# Altium schematic sheet VISHIPEL_ver1.2.SchDoc: mach_mau
size 594 x 420 mm; Author: thaipham; SheetNumber: 1; SheetTotal: 1
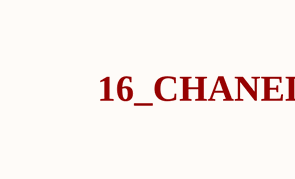
[diagram p0: VISHIPEL_ver1.2.SchDoc, top left]
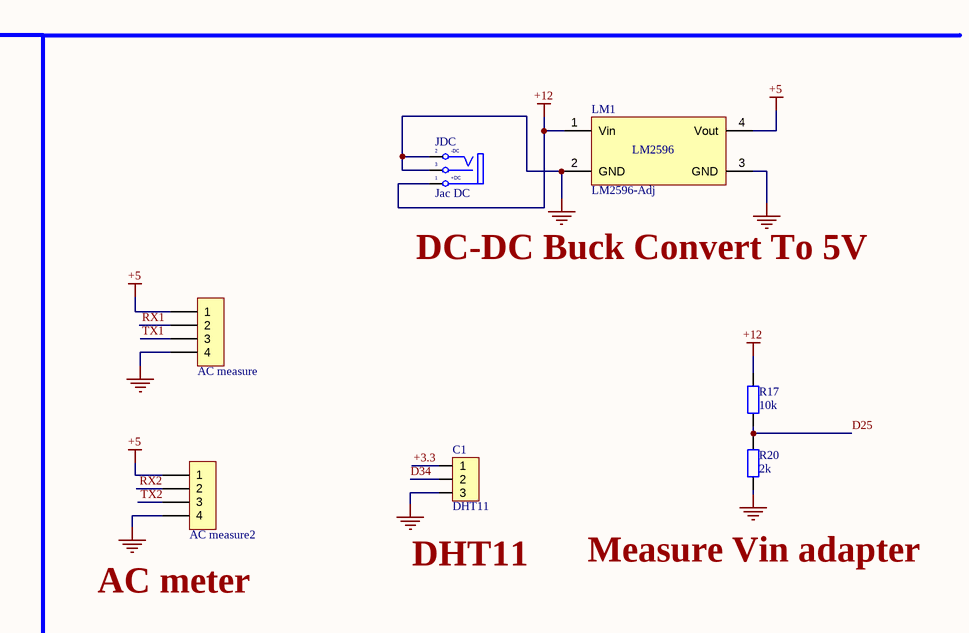
[diagram p1: VISHIPEL_ver1.2.SchDoc, top right]
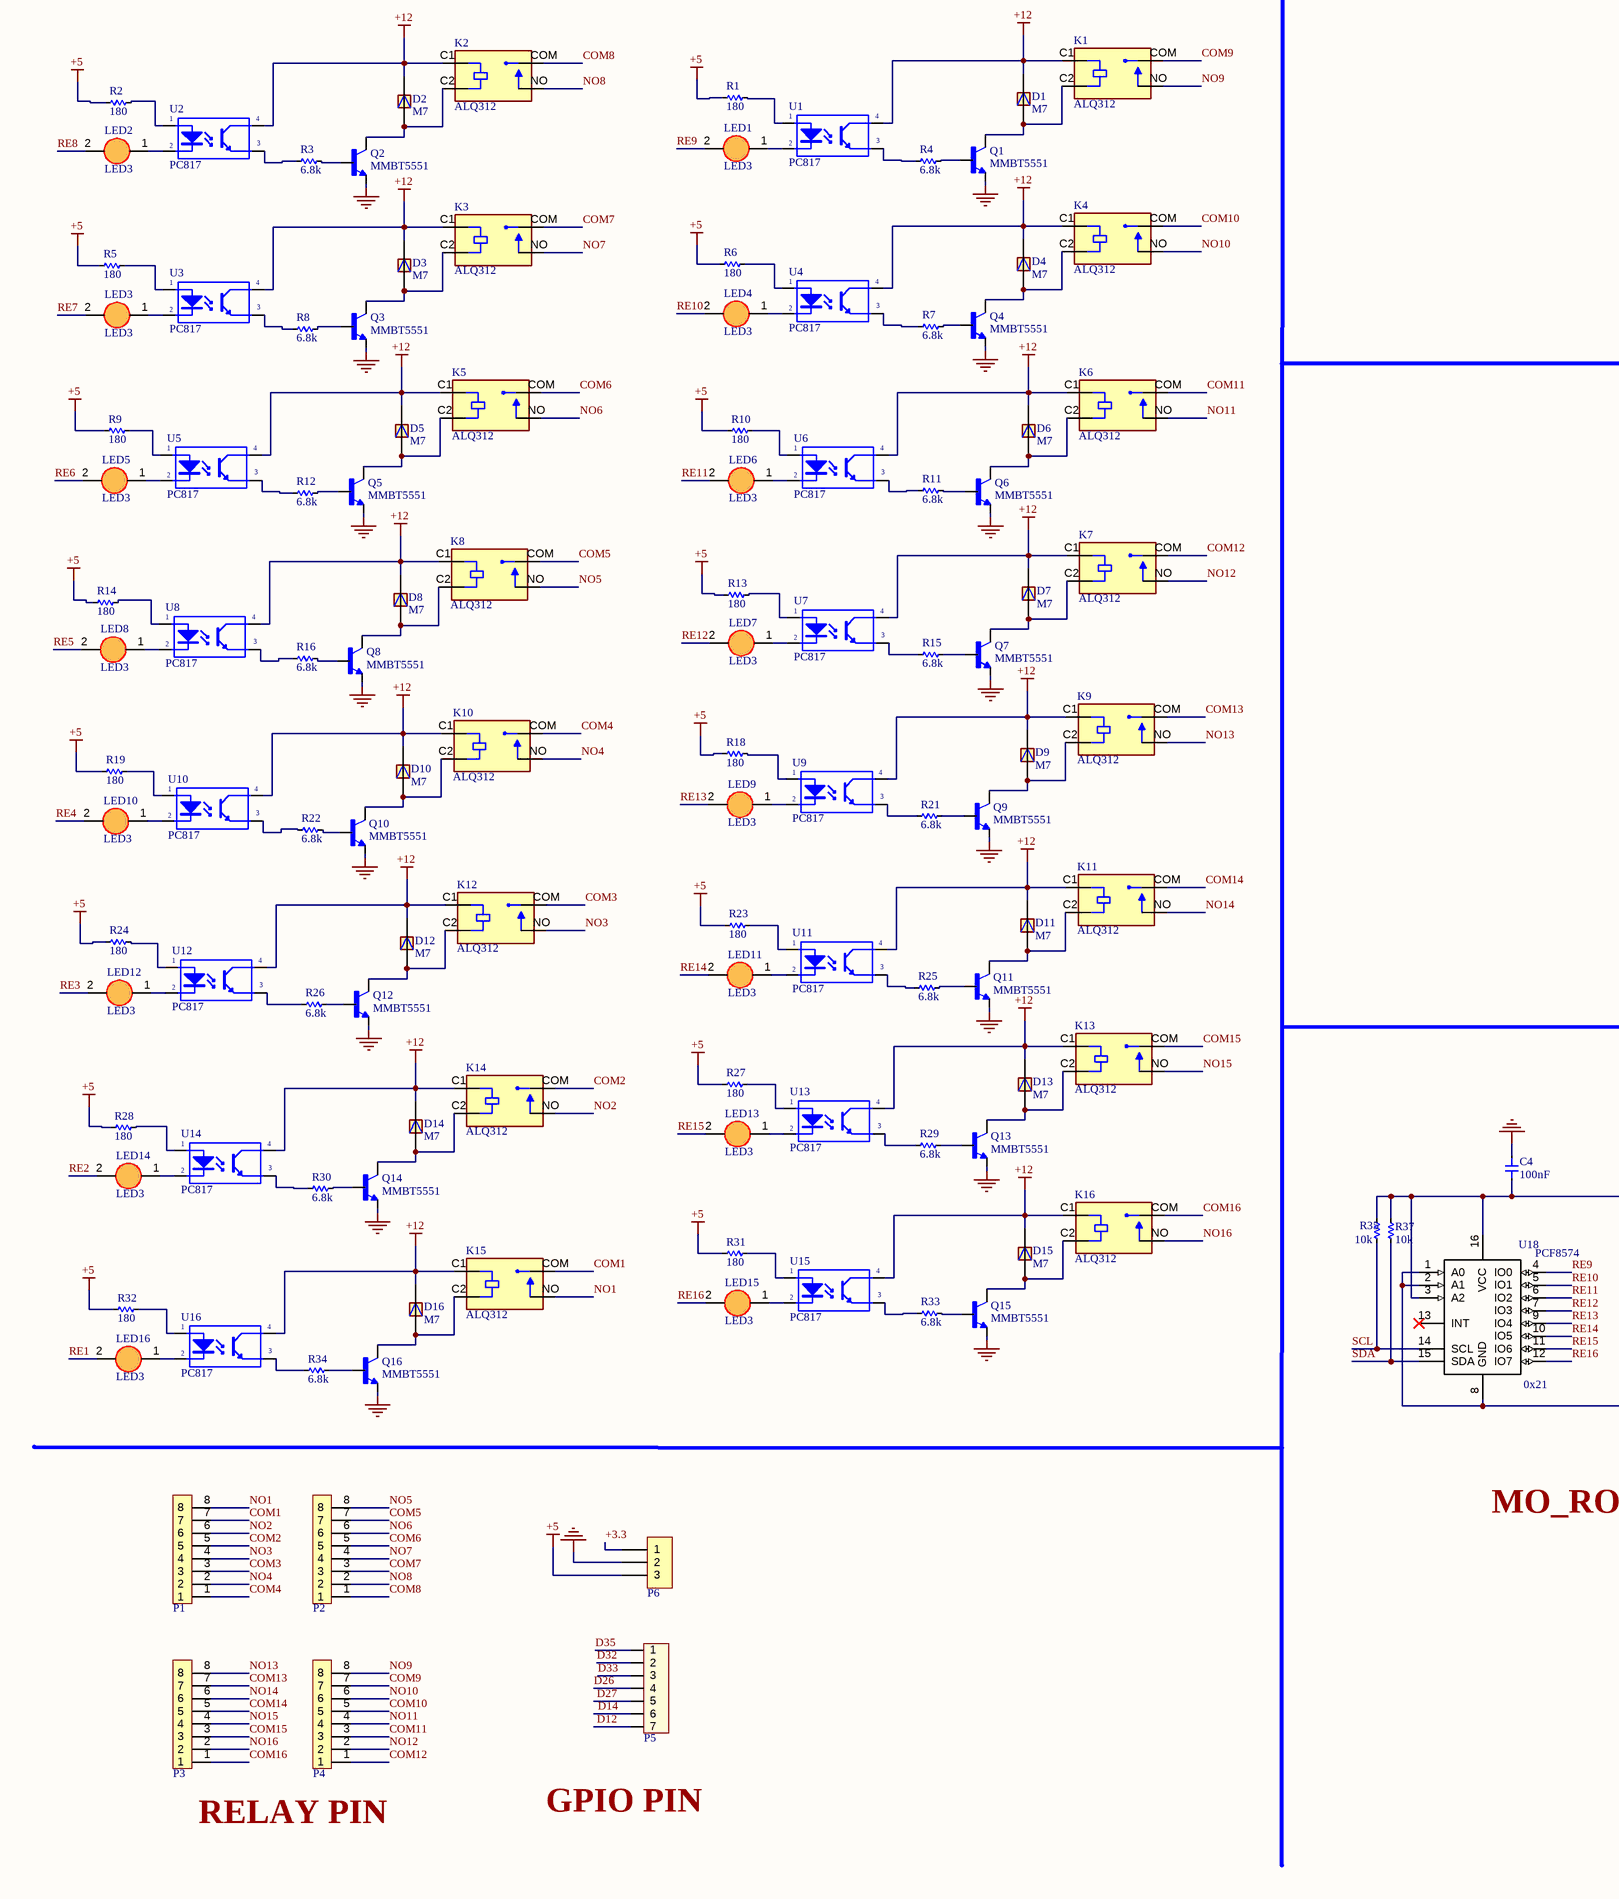
[diagram p2: VISHIPEL_ver1.2.SchDoc, bottom left]
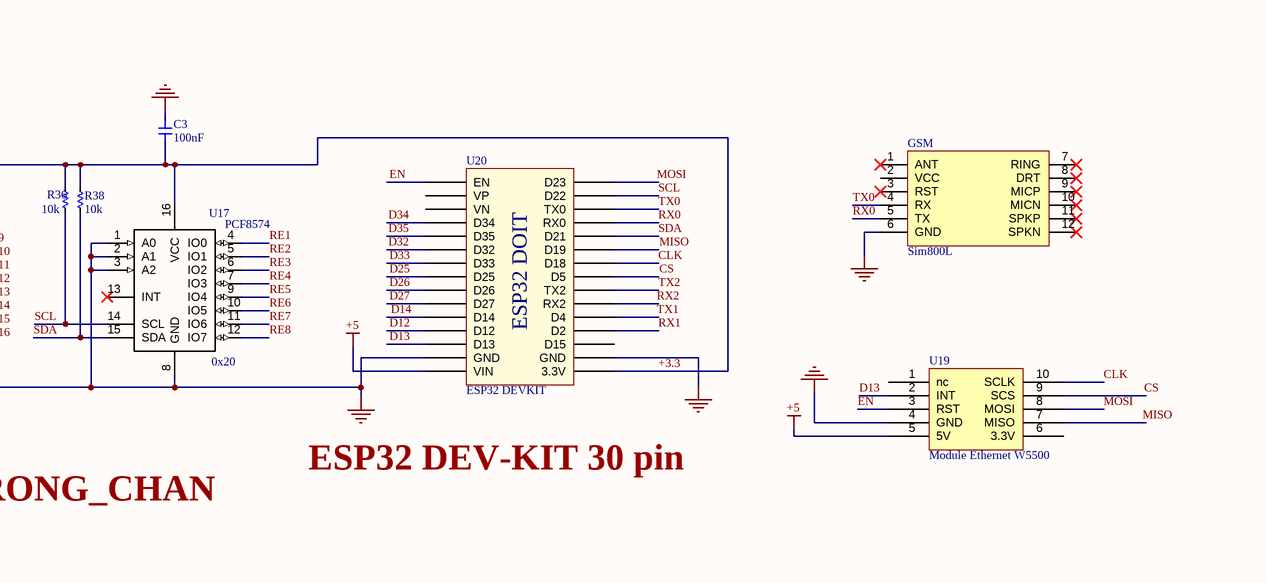
[diagram p3: VISHIPEL_ver1.2.SchDoc, bottom right]

## Parts
C1  DHT11  [Header3]
C3  100nF  [Cap 0805]
C4  100nF  [Cap 0805]
D1  M7  [DIOM505270X240]
D2  M7  [DIOM505270X240]
D3  M7  [DIOM505270X240]
D4  M7  [DIOM505270X240]
D5  M7  [DIOM505270X240]
D6  M7  [DIOM505270X240]
D7  M7  [DIOM505270X240]
D8  M7  [DIOM505270X240]
D9  M7  [DIOM505270X240]
D10  M7  [DIOM505270X240]
D11  M7  [DIOM505270X240]
D12  M7  [DIOM505270X240]
D13  M7  [DIOM505270X240]
D14  M7  [DIOM505270X240]
D15  M7  [DIOM505270X240]
D16  M7  [DIOM505270X240]
GSM  Sim800L  [Sim800L]
H1  AC measure  [XH2.54M-4]
H2  AC measure2  [XH2.54M-4]
H3  P6  [VH3.96M-3]
H4  P5  [VH3.96M-7]
JDC  Jac DC  [DC-IN]
K1  ALQ312  [RELAY_ALQ312]
K2  ALQ312  [RELAY_ALQ312]
K3  ALQ312  [RELAY_ALQ312]
K4  ALQ312  [RELAY_ALQ312]
K5  ALQ312  [RELAY_ALQ312]
K6  ALQ312  [RELAY_ALQ312]
K7  ALQ312  [RELAY_ALQ312]
K8  ALQ312  [RELAY_ALQ312]
K9  ALQ312  [RELAY_ALQ312]
K10  ALQ312  [RELAY_ALQ312]
K11  ALQ312  [RELAY_ALQ312]
K12  ALQ312  [RELAY_ALQ312]
K13  ALQ312  [RELAY_ALQ312]
K14  ALQ312  [RELAY_ALQ312]
K15  ALQ312  [RELAY_ALQ312]
K16  ALQ312  [RELAY_ALQ312]
LED1  LED3  [LED3mm]
LED2  LED3  [LED3mm]
LED3  LED3  [LED3mm]
LED4  LED3  [LED3mm]
LED5  LED3  [LED3mm]
LED6  LED3  [LED3mm]
LED7  LED3  [LED3mm]
LED8  LED3  [LED3mm]
LED9  LED3  [LED3mm]
LED10  LED3  [LED3mm]
LED11  LED3  [LED3mm]
LED12  LED3  [LED3mm]
LED13  LED3  [LED3mm]
LED14  LED3  [LED3mm]
LED15  LED3  [LED3mm]
LED16  LED3  [LED3mm]
LM1  LM2596-Adj  [lm2596]
P1  BIG Heager 8  [BIG_Header 8]  (value not drawn)
P2  BIG Heager 8  [BIG_Header 8]  (value not drawn)
P3  BIG Heager 8  [BIG_Header 8]  (value not drawn)
P4  BIG Heager 8  [BIG_Header 8]  (value not drawn)
Q1  MMBT5551  [SOT23-3]
Q2  MMBT5551  [SOT23-3]
Q3  MMBT5551  [SOT23-3]
Q4  MMBT5551  [SOT23-3]
Q5  MMBT5551  [SOT23-3]
Q6  MMBT5551  [SOT23-3]
Q7  MMBT5551  [SOT23-3]
Q8  MMBT5551  [SOT23-3]
Q9  MMBT5551  [SOT23-3]
Q10  MMBT5551  [SOT23-3]
Q11  MMBT5551  [SOT23-3]
Q12  MMBT5551  [SOT23-3]
Q13  MMBT5551  [SOT23-3]
Q14  MMBT5551  [SOT23-3]
Q15  MMBT5551  [SOT23-3]
Q16  MMBT5551  [SOT23-3]
R1  180  [RES-SMD-0101]
R2  180  [RES-SMD-0101]
R3  6.8k  [RES-SMD-0101]
R4  6.8k  [RES-SMD-0101]
R5  180  [RES-SMD-0101]
R6  180  [RES-SMD-0101]
R7  6.8k  [RES-SMD-0101]
R8  6.8k  [RES-SMD-0101]
R9  180  [RES-SMD-0101]
R10  180  [RES-SMD-0101]
R11  6.8k  [RES-SMD-0101]
R12  6.8k  [RES-SMD-0101]
R13  180  [RES-SMD-0101]
R14  180  [RES-SMD-0101]
R15  6.8k  [RES-SMD-0101]
R16  6.8k  [RES-SMD-0101]
R17  value 10k  [DIEN TRO 1/4 W]  (hidden comment: R0.4W)
R18  180  [RES-SMD-0101]
R19  180  [RES-SMD-0101]
R20  value 2k  [DIEN TRO 1/4 W]  (hidden comment: R0.4W)
R21  6.8k  [RES-SMD-0101]
R22  6.8k  [RES-SMD-0101]
R23  180  [RES-SMD-0101]
R24  180  [RES-SMD-0101]
R25  6.8k  [RES-SMD-0101]
R26  6.8k  [RES-SMD-0101]
R27  180  [RES-SMD-0101]
R28  180  [RES-SMD-0101]
R29  6.8k  [RES-SMD-0101]
R30  6.8k  [RES-SMD-0101]
R31  180  [RES-SMD-0101]
R32  180  [RES-SMD-0101]
R33  6.8k  [RES-SMD-0101]
R34  6.8k  [RES-SMD-0101]
R35  10k  [RES-SMD-0101]
R36  10k  [RES-SMD-0101]
R37  10k  [RES-SMD-0101]
R38  10k  [RES-SMD-0101]
U1  PC817  [DIP4/W0.3]
U2  PC817  [DIP4/W0.3]
U3  PC817  [DIP4/W0.3]
U4  PC817  [DIP4/W0.3]
U5  PC817  [DIP4/W0.3]
U6  PC817  [DIP4/W0.3]
U7  PC817  [DIP4/W0.3]
U8  PC817  [DIP4/W0.3]
U9  PC817  [DIP4/W0.3]
U10  PC817  [DIP4/W0.3]
U11  PC817  [DIP4/W0.3]
U12  PC817  [DIP4/W0.3]
U13  PC817  [DIP4/W0.3]
U14  PC817  [DIP4/W0.3]
U15  PC817  [DIP4/W0.3]
U16  PC817  [DIP4/W0.3]
U17  PCF8574  [DIP16]
U18  PCF8574  [DIP16]
U19  Module Ethernet W5500  [Module Ethernet W5500]
U20  ESP32 DEVKIT  [ESP32 WROOM 32 KIT]

## Nets
+5: H1.1 H2.1 H3.3 LM1.4(Vout) R1.1 R2.1 R5.1 R6.1 R9.1 R10.1 R13.1 R14.1 R18.1 R19.1 R23.1 R24.1 R27.1 R28.1 R31.1 R32.1 U19.5(5V) U20.15(VIN)
+12: D1.C D2.C D3.C D4.C D5.C D6.C D7.C D8.C D9.C D10.C D11.C D12.C D13.C D14.C D15.C D16.C JDC.1(T) K1.C1(COIL1) K2.C1(COIL1) K3.C1(COIL1) K4.C1(COIL1) K5.C1(COIL1) K6.C1(COIL1) K7.C1(COIL1) K8.C1(COIL1) K9.C1(COIL1) K10.C1(COIL1) K11.C1(COIL1) K12.C1(COIL1) K13.C1(COIL1) K14.C1(COIL1) K15.C1(COIL1) K16.C1(COIL1) LM1.1(Vin) R17.2 U1.4(C) U2.4(C) U3.4(C) U4.4(C) U5.4(C) U6.4(C) U7.4(C) U8.4(C) U9.4(C) U10.4(C) U11.4(C) U12.4(C) U13.4(C) U14.4(C) U15.4(C) U16.4(C)
GND: C1.3 C3.1 C4.1 GSM.6(GND) H1.4 H2.4 H3.2 JDC.2(TN) JDC.3(S) LM1.2(GND) LM1.3(GND) Q1.2(E) Q2.2(E) Q3.2(E) Q4.2(E) Q5.2(E) Q6.2(E) Q7.2(E) Q8.2(E) Q9.2(E) Q10.2(E) Q11.2(E) Q12.2(E) Q13.2(E) Q14.2(E) Q15.2(E) Q16.2(E) R20.1 U17.1(A0) U17.2(A1) U17.3(A2) U17.8(GND) U18.1(A0) U18.2(A1) U18.8(GND) U19.4(GND) U20.14(GND) U20.17(GND)
+3.3: C1.1 C3.2 C4.2 H3.1 R35.1 R36.1 R37.1 R38.1 U17.16(VCC) U18.3(A2) U18.16(VCC) U20.16(3.3V)
CLK: U19.10(SCLK) U20.24(D18)
COM1: K15.COM P1.7
COM2: K14.COM P1.5
COM3: K12.COM P1.3
COM4: K10.COM P1.1
COM5: K8.COM P2.7
COM6: K5.COM P2.5
COM7: K3.COM P2.3
COM8: K2.COM P2.1
COM9: K1.COM P4.7
COM10: K4.COM P4.5
COM11: K6.COM P4.3
COM12: K7.COM P4.1
COM13: K9.COM P3.7
COM14: K11.COM P3.5
COM15: K13.COM P3.3
COM16: K16.COM P3.1
CS: U19.9(SCS) U20.23(D5)
D12: H4.7 U20.12(D12)
D13: U19.2(INT) U20.13(D13)
D14: H4.6 U20.11(D14)
D25: R17.1 R20.2 U20.8(D25)
D26: H4.4 U20.9(D26)
D27: H4.5 U20.10(D27)
D32: H4.2 U20.6(D32)
D33: H4.3 U20.7(D33)
D34: C1.2 U20.4(D34)
D35: H4.1 U20.5(D35)
EN: U19.3(RST) U20.1(EN)
MISO: U19.7(MISO) U20.25(D19)
MOSI: U19.8(MOSI) U20.30(D23)
NO1: K15.NO P1.8
NO2: K14.NO P1.6
NO3: K12.NO P1.4
NO4: K10.NO P1.2
NO5: K8.NO P2.8
NO6: K5.NO P2.6
NO7: K3.NO P2.4
NO8: K2.NO P2.2
NO9: K1.NO P4.8
NO10: K4.NO P4.6
NO11: K6.NO P4.4
NO12: K7.NO P4.2
NO13: K9.NO P3.8
NO14: K11.NO P3.6
NO15: K13.NO P3.4
NO16: K16.NO P3.2
RE1: LED16.2(K) U17.4(IO0)
RE2: LED14.2(K) U17.5(IO1)
RE3: LED12.2(K) U17.6(IO2)
RE4: LED10.2(K) U17.7(IO3)
RE5: LED8.2(K) U17.9(IO4)
RE6: LED5.2(K) U17.10(IO5)
RE7: LED3.2(K) U17.11(IO6)
RE8: LED2.2(K) U17.12(IO7)
RE9: LED1.2(K) U18.4(IO0)
RE10: LED4.2(K) U18.5(IO1)
RE11: LED6.2(K) U18.6(IO2)
RE12: LED7.2(K) U18.7(IO3)
RE13: LED9.2(K) U18.9(IO4)
RE14: LED11.2(K) U18.10(IO5)
RE15: LED13.2(K) U18.11(IO6)
RE16: LED15.2(K) U18.12(IO7)
RX0: GSM.5(TX) U20.27(RX0)
RX1: H1.2 U20.19(D2)
RX2: H2.2 U20.21(RX2)
SCL: R35.2 R36.2 U17.14(SCL) U18.14(SCL) U20.29(D22)
SDA: R37.2 R38.2 U17.15(SDA) U18.15(SDA) U20.26(D21)
TX0: GSM.4(RX) U20.28(TX0)
TX1: H1.3 U20.20(D4)
TX2: H2.3 U20.22(TX2)
NetD1_A: D1.A K1.C2(COIL2) Q1.3(C)
NetD2_A: D2.A K2.C2(COIL2) Q2.3(C)
NetD3_A: D3.A K3.C2(COIL2) Q3.3(C)
NetD4_A: D4.A K4.C2(COIL2) Q4.3(C)
NetD5_A: D5.A K5.C2(COIL2) Q5.3(C)
NetD6_A: D6.A K6.C2(COIL2) Q6.3(C)
NetD7_A: D7.A K7.C2(COIL2) Q7.3(C)
NetD8_A: D8.A K8.C2(COIL2) Q8.3(C)
NetD9_A: D9.A K9.C2(COIL2) Q9.3(C)
NetD10_A: D10.A K10.C2(COIL2) Q10.3(C)
NetD11_A: D11.A K11.C2(COIL2) Q11.3(C)
NetD12_A: D12.A K12.C2(COIL2) Q12.3(C)
NetD13_A: D13.A K13.C2(COIL2) Q13.3(C)
NetD14_A: D14.A K14.C2(COIL2) Q14.3(C)
NetD15_A: D15.A K16.C2(COIL2) Q15.3(C)
NetD16_A: D16.A K15.C2(COIL2) Q16.3(C)
NetLED1_1: LED1.1(A) U1.2(K)
NetLED2_1: LED2.1(A) U2.2(K)
NetLED3_1: LED3.1(A) U3.2(K)
NetLED4_1: LED4.1(A) U4.2(K)
NetLED5_1: LED5.1(A) U5.2(K)
NetLED6_1: LED6.1(A) U6.2(K)
NetLED7_1: LED7.1(A) U7.2(K)
NetLED8_1: LED8.1(A) U8.2(K)
NetLED9_1: LED9.1(A) U9.2(K)
NetLED10_1: LED10.1(A) U10.2(K)
NetLED11_1: LED11.1(A) U11.2(K)
NetLED12_1: LED12.1(A) U12.2(K)
NetLED13_1: LED13.1(A) U13.2(K)
NetLED14_1: LED14.1(A) U14.2(K)
NetLED15_1: LED15.1(A) U15.2(K)
NetLED16_1: LED16.1(A) U16.2(K)
NetQ1_1: Q1.1(B) R4.2
NetQ2_1: Q2.1(B) R3.2
NetQ3_1: Q3.1(B) R8.2
NetQ4_1: Q4.1(B) R7.2
NetQ5_1: Q5.1(B) R12.2
NetQ6_1: Q6.1(B) R11.2
NetQ7_1: Q7.1(B) R15.2
NetQ8_1: Q8.1(B) R16.2
NetQ9_1: Q9.1(B) R21.2
NetQ10_1: Q10.1(B) R22.2
NetQ11_1: Q11.1(B) R25.2
NetQ12_1: Q12.1(B) R26.2
NetQ13_1: Q13.1(B) R29.2
NetQ14_1: Q14.1(B) R30.2
NetQ15_1: Q15.1(B) R33.2
NetQ16_1: Q16.1(B) R34.2
NetR1_2: R1.2 U1.1(A)
NetR2_2: R2.2 U2.1(A)
NetR3_1: R3.1 U2.3(E)
NetR4_1: R4.1 U1.3(E)
NetR5_2: R5.2 U3.1(A)
NetR6_2: R6.2 U4.1(A)
NetR7_1: R7.1 U4.3(E)
NetR8_1: R8.1 U3.3(E)
NetR9_2: R9.2 U5.1(A)
NetR10_2: R10.2 U6.1(A)
NetR11_1: R11.1 U6.3(E)
NetR12_1: R12.1 U5.3(E)
NetR13_2: R13.2 U7.1(A)
NetR14_2: R14.2 U8.1(A)
NetR15_1: R15.1 U7.3(E)
NetR16_1: R16.1 U8.3(E)
NetR18_2: R18.2 U9.1(A)
NetR19_2: R19.2 U10.1(A)
NetR21_1: R21.1 U9.3(E)
NetR22_1: R22.1 U10.3(E)
NetR23_2: R23.2 U11.1(A)
NetR24_2: R24.2 U12.1(A)
NetR25_1: R25.1 U11.3(E)
NetR26_1: R26.1 U12.3(E)
NetR27_2: R27.2 U13.1(A)
NetR28_2: R28.2 U14.1(A)
NetR29_1: R29.1 U13.3(E)
NetR30_1: R30.1 U14.3(E)
NetR31_2: R31.2 U15.1(A)
NetR32_2: R32.2 U16.1(A)
NetR33_1: R33.1 U15.3(E)
NetR34_1: R34.1 U16.3(E)

Not connected (* = marked no-connect by the designer): GSM 1(ANT)* 2(VCC) 3(RST)* 7(RING)* 8(DRT)* 9(MICP)* 10(MICN)* 11(SPKP)* 12(SPKN)*; U17 13(INT)*; U18 13(INT)*; U19 1(nc) 6(3.3V); U20 2(VP) 3(VN) 18(D15)

## Notes on the sheet
- 16_CHANEL_RELAY
- DC-DC Buck Convert To 5V
- (near H2) AC meter
- (near C1) DHT11
- Measure Vin adapter
- (near U18) 0x21
- (near U17) 0x20
- MO_RONG_CHAN
- ESP32 DEV-KIT 30 pin
- RELAY PIN
- GPIO PIN
- DWG NO:
- REV:
- THIS DOCUMENT AND THE DATA DISCLOSED HEREIN OR
- HEREWITH IS THE PROPERTY OF ALTIUM LIMITED AND MAY
- BE FREELY DISTRIBUTED IN WHOLE. NO RIGHTS ARE
- RESERVED OR EXPRESS OR IMPLIED WARANTEE GIVEN.
- REVISION
- DESCRIPTION
- DATE
- APPROVED
- ENG:
- APPROVALS
- PROJECT
- DSN:
- CHK:
- REFERENCE DOCUMENTS
- PROJECT REVISION:
- TITLE
- DOCUMENT REVISION:
- DESIGN ITEM:
- BOM:
- FAB DWG:
- PCB DWG:
- ASSY DWG:
- SCALE:
- A2
- SIZE
- CAGE CODE
- FILE NAME
- DWG NO.
- SHEET
- OF
- REV
- (in symbol DCIN) -DC; +DC
- (in symbol ESP32 WROOM 32 KIT) ESP32 DOIT
- (in symbol LM2596-Adj) LM2596

## Library data of the parts
C1 = Header3: Header IDC, 3 x 1 Pin Vertical 2.54mm Pitch (Non-Boxed, Male); Manufacturer: W¨¹rth Elektronik eiSos GmbH; partNo: 613002143121; ComponentLink1 Description: Manufacturer; ComponentLink2 Description: Datasheet; NoPins: 02; Created Date: 29 March 2013; ComponentLink1URL: http://www.we-online.com; ComponentLink2URL: http://katalog.we-online.de/em/datasheet/6130xx143121.pdf; Created by: Karrer Zheng
C3 C4 = Cap 0805: Capacitor SMD 0805
D1-D16 = M7: Diode, SMA, 1000V, 1A, 150Â°C; MF: Diotec Semiconductor; SnapEDA_Link: https://www.snapeda.com/parts/M7/Diotec/view-part/?ref=snap; Package: DO-214AC Diotec; Value: *; MP: M7; Check_prices: https://www.snapeda.com/parts/M7/Diotec/view-part/?ref=eda
H1 H2 = Header 4P 2.54 Duc Thang: Cắm; Ten_Linh_Kien: Header 4P XH2.54-4P Đực Thẳng; Don_Vi: Con; Ma_Hang: MH001285; Chung_Loai: Cắm
H3 = Header 3P VH3.96 Duc Thang: Cắm; Ten_Linh_Kien: Header 3P XH2.54-3P Đực Thẳng; Don_Vi: Con; Ma_Hang: MH001292; Chung_Loai: Cắm
H4 = Header 7P VH3.96 Duc Thang: Cắm; Ten_Linh_Kien: Header 7P XH2.54-7P Đực Thẳng; Don_Vi: Con; Ma_Hang: MH003369; Chung_Loai: Cắm
JDC = DCIN: Jac DC input; Value: Jac DC
K1-K16 = ALQ312: General Purpose Relay SPST-NO (1 Form A) 12VDC Coil Through Hole; MF: Panasonic Electric; Package: DIP-4; Price: None; Value: *; SnapEDA_Link: https://www.snapeda.com/parts/ALQ312/Panasonic+Electric+Works/view-part/?ref=snap; MP: ALQ312; Availability: Unavailable; Check_prices: https://www.snapeda.com/parts/ALQ312/Panasonic+Electric+Works/view-part/?ref=eda
LED1-LED16 = LED 3mm
LM1 = LM2596-Adj: Designed By @Alixahedi
P1-P4 = BIG_Header 8
Q1-Q16 = MMBT5551: This device is designed for general purpose high voltage amplifiers and gas discharge display drivers.; MF: Fairchild Semiconductor; SnapEDA_Link: https://www.snapeda.com/parts/MMBT5551/Fairchild+Imaging/view-part/?ref=snap; Package: SOT-23-3 Fairchild Semiconductor; Value: *; MP: MMBT5551; Check_prices: https://www.snapeda.com/parts/MMBT5551/Fairchild+Imaging/view-part/?ref=eda
R1-R16 R18 R19 R21-R38 = Res-SMD: Resistor; Manufacturer: Generic Components; Class: Passive; Published: 08/06/2000; Publisher: Altium Hobart Technology Centre
R17 R20 = Res 1/4 W: Resistor; Published: 8-Jun-2000; LatestRevisionDate: 17-Jul-2002; LatestRevisionNote: Re-released for DXP Platform.; PackageReference: AXIAL-0.4; Publisher: Altium Limited
U1-U16 = PC817: Single Opto; Value: PC817
U17 U18 = PCF8574: I2C PORT EXPANDER; Manufacturer Part Number: PCF8574T/3,512; Manufacturer: NXP Semiconductors; Includes: POR; Interface: I²C; Interrupt Output: Yes; Number of I /O: 8; Voltage - Supply: 2.5 V ~ 6 V; Frequency - Clock: 100KHz; Supplier 1: Digi-Key; Supplier Part Number 1: 568-1076-5-ND; Package / Case: 16-SOIC (7.5mm Width); Category: Integrated Circuits (ICs); Supplier Part Number: 568-1076-5-ND; Operating Temperature: -40°C ~ 85°C; Packaging: Tube; RoHS: RoHS Compliant; Supplier: Digi-Key
U20 = ESP32 WROOM 32 KIT